# Altium project 单体V0.3.PrjPcb
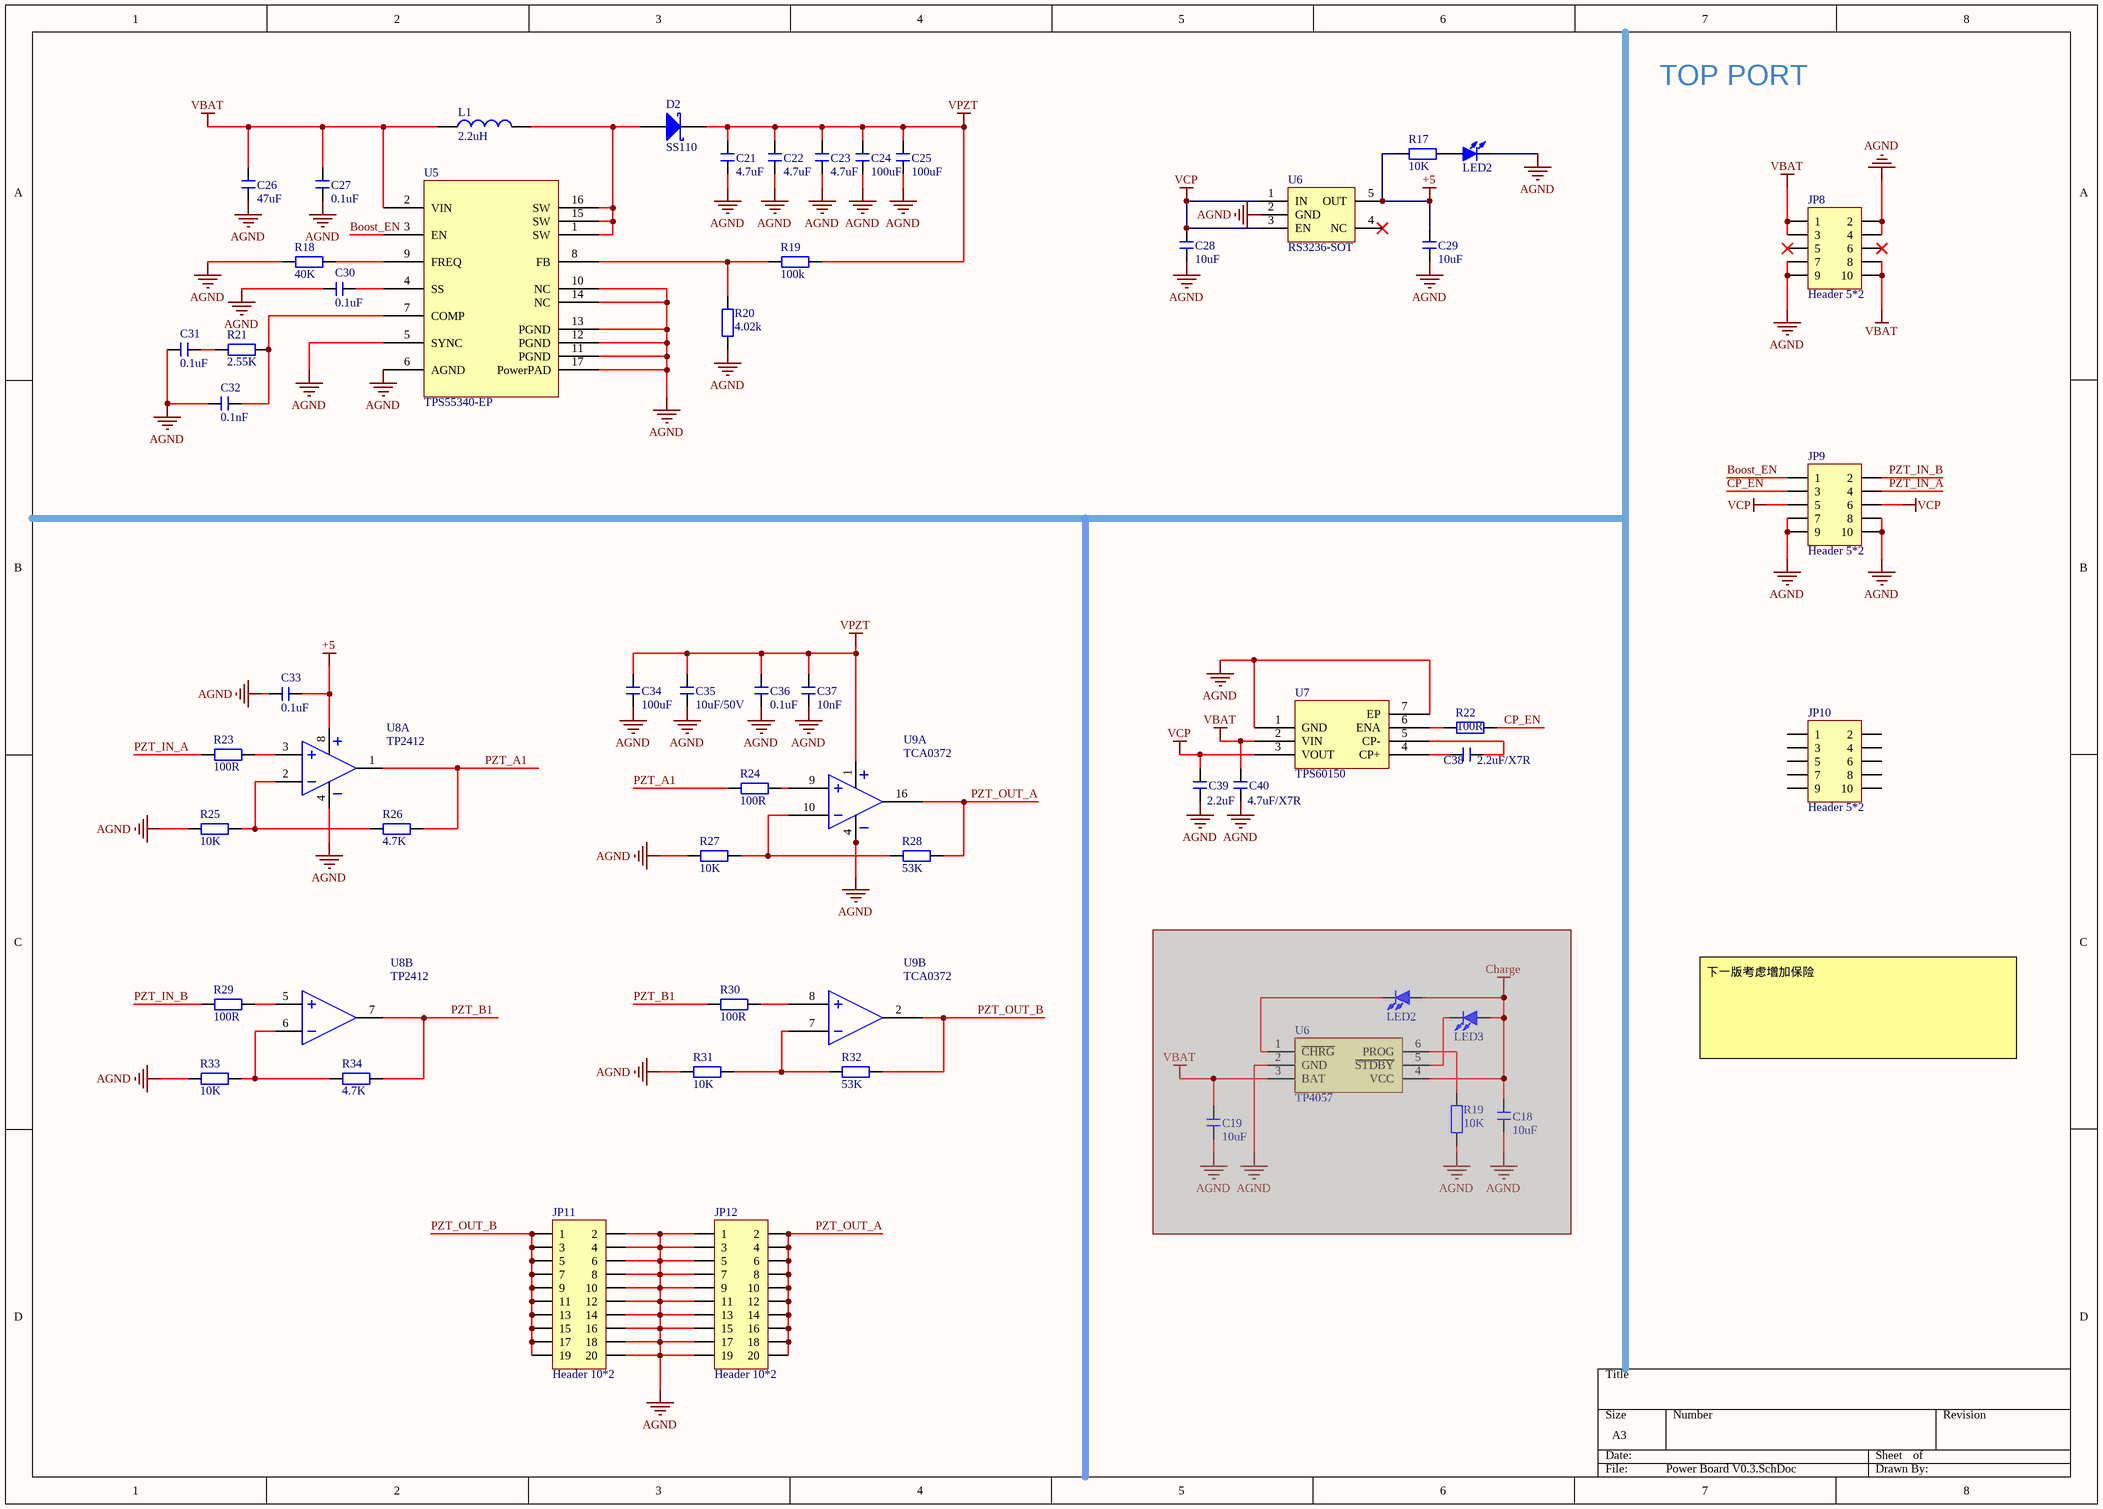
[diagram p0: Power Board V0.3.SchDoc]
5 sheets, 153 parts. Net scope: global (net labels, ports and power ports of the same name join across sheets).
Board files: Power Board V0.3.PcbDoc, Controller Board V0.3.PcbDoc, Function Board V0.3.PcbDoc, PZT Board.PcbDoc, DAP Board V0.3.PcbDoc
Sheets:
  Power Board V0.3.SchDoc
  Controller Board V0.3.SchDoc
  Function Board V0.3.SchDoc
  PZT Board.SchDoc
  DAP Board V0.3.SchDoc

## Sheet Power Board V0.3.SchDoc
size A3; SheetNumber: 1; SheetTotal: 4

### Parts
(Parts that share a designator on the sheet are numbered #1, #2 ... from top to bottom, then left to right.)
C18#1  10uF  [C 0603_L]  (masked out: inside a compile mask, not in the netlist)
C19#1  10uF  [C 0603_L]  (masked out: inside a compile mask, not in the netlist)
C21  4.7uF  [C 0603_L]
C22  4.7uF  [C 0603_L]
C23  4.7uF  [C 0603_L]
C24  100uF  [C 1206_L]
C25  100uF  [C 1206_L]
C26  47uF  [C 1206_L]
C27  0.1uF  [C 0603_L]
C28  10uF  [C 0603_L]
C29  10uF  [C 0603_L]
C30  0.1uF  [C 0603_L]
C31  0.1uF  [C 0603_L]
C32  0.1nF  [C 0603_L]
C33  0.1uF  [C 0603_L]
C34  100uF  [C 1206_L]
C35  10uF/50V  [C 0805_L]
C36  0.1uF  [C 0603_L]
C37  10nF  [C 0603_L]
C38  2.2uF/X7R  [C 0603_L]
C39  2.2uF  [C 0603_L]
C40  4.7uF/X7R  [C 0603_L]
D2  SS110  [SMA]
JP8  Header 5*2  [BTB-0.8mm-SMD-F-2*5PIN]
JP9  Header 5*2  [BTB-0.8mm-SMD-F-2*5PIN]
JP10  Header 5*2  [BTB-0.8mm-SMD-F-2*5PIN]
JP11  Header 10*2  [BTB-0.5MM-SMD-F_2*10PIN]
JP12  Header 10*2  [BTB-0.5MM-SMD-F_2*10PIN]
L1  2.2uH  [0530]
LED2#1  红色  [LED 0603G]  (value not drawn)
LED2#2  红色  [LED 0603R]  (value not drawn)  (masked out: inside a compile mask, not in the netlist)
LED3  红色  [LED 0603G]  (value not drawn)  (masked out: inside a compile mask, not in the netlist)
R17  10K  [R 0603_L]
R18  40K  [R 0603_L]
R19#1  100k  [R 0603_L]
R19#2  10K  [R 0603_L]  (masked out: inside a compile mask, not in the netlist)
R20  4.02k  [R 0603_L]
R21#1  2.55K  [R 0603_L]
R22  100R  [R 0603_L]
R23  100R  [R 0603_L]
R24  100R  [R 0603_L]
R25  10K  [R 0603_L]
R26  4.7K  [R 0603_L]
R27  10K  [R 0603_L]
R28  53K  [R 0603_L]
R29  100R  [R 0603_L]
R30  100R  [R 0603_L]
R31  10K  [R 0603_L]
R32  53K  [R 0603_L]
R33  10K  [R 0603_L]
R34  4.7K  [R 0603_L]
U5  TPS55340-EP  [QFN16]
U6#1  RS3236-SOT  [SOT23-5L]
U6#2  TP4057  [SOT23-6L]  (masked out: inside a compile mask, not in the netlist)
U7  TPS60150  [WSON-6Pin]
U8  TP2412  [MSOP8_L]  (parts A,B of 2)
U9  TCA0372  [SOP16W_N]  (parts A,B of 2)

### Nets
+5: C29.2 C33.2 R17.2 U6#1.5(OUT) U8.8(+Vs)
AGND: C21.1 C22.1 C23.1 C24.1 C25.1 C26.1 C27.1 C28.1 C29.1 C30.1 C31.1 C32.1 C33.1 C34.1 C35.1 C36.1 C37.2 C39.1 C40.1 JP8.2 JP8.4 JP8.7 JP8.9 JP9.7 JP9.8 JP9.9 JP9.10 JP11.2 JP11.4 JP11.6 JP11.8 JP11.10 JP11.12 JP11.14 JP11.16 JP11.18 JP11.20 JP12.1 JP12.3 JP12.5 JP12.7 JP12.9 JP12.11 JP12.13 JP12.15 JP12.17 JP12.19 LED2#1.2(K) R18.1 R20.1 R25.1 R27.1 R31.1 R33.1 U5.5(SYNC) U5.6(AGND) U5.10(NC) U5.11(PGND) U5.12(PGND) U5.13(PGND) U5.14(NC) U5.17(PowerPAD) U6#1.2(GND) U7.1(GND) U7.7(EP) U8.4(-Vs) U9.4(GND) U9.5(GND) U9.12(GND) U9.13(GND)
VBAT: C26.2 C27.2 C40.2 JP8.1 JP8.3 JP8.8 JP8.10 L1.1 U5.2(VIN) U7.2(VIN)
VCP: C28.2 C39.2 JP9.5 JP9.6 U6#1.1(IN) U6#1.3(EN) U7.3(VOUT)
VPZT: C21.2 C22.2 C23.2 C24.2 C25.2 C34.2 C35.2 C36.2 C37.1 D2.2(K) R19#1.2 U9.1
Boost_EN: JP9.1 U5.3(EN)
CP_EN: JP9.3 R22.1
PZT_A1: R24.1 R26.2 U8.1(Out)
PZT_B1: R30.1 R34.2 U8.7(Out)
PZT_IN_A: JP9.4 R23.1
PZT_IN_B: JP9.2 R29.1
PZT_OUT_A: JP12.2 JP12.4 JP12.6 JP12.8 JP12.10 JP12.12 JP12.14 JP12.16 JP12.18 JP12.20 R28.2 U9.16
PZT_OUT_B: JP11.1 JP11.3 JP11.5 JP11.7 JP11.9 JP11.11 JP11.13 JP11.15 JP11.17 JP11.19 R32.2 U9.2
NetC30_2: C30.2 U5.4(SS)
NetC31_2: C31.2 R21#1.1
NetC32_2: C32.2 R21#1.2 U5.7(COMP)
NetC38_1: C38.1 U7.4(CP+)
NetC38_2: C38.2 U7.5(CP-)
NetD2_1: D2.1(A) L1.2 U5.1(SW) U5.15(SW) U5.16(SW)
NetLED2#1_1: LED2#1.1(A) R17.1
NetR18_2: R18.2 U5.9(FREQ)
NetR19#1_1: R19#1.1 R20.2 U5.8(FB)
NetR22_2: R22.2 U7.6(ENA)
NetR23_2: R23.2 U8.3(In+)
NetR24_2: R24.2 U9.9
NetR25_2: R25.2 R26.1 U8.2(In-)
NetR27_2: R27.2 R28.1 U9.10
NetR29_2: R29.2 U8.5(In+)
NetR30_2: R30.2 U9.8
NetR31_2: R31.2 R32.1 U9.7
NetR33_2: R33.2 R34.1 U8.6(In-)

Not connected (* = marked no-connect by the designer): JP8 5* 6*; JP10 1 2 3 4 5 6 7 8 9 10; U6#1 4(NC)*

### Notes on the sheet
- TOP PORT
- 下一版考虑增加保险

### Library data of the parts
C18#1 C19#1 C21-C40 = C: 贴片电容; BOM名称: 无极性贴片电容; 淘宝ID: 封装库来自淘宝 ID：黄晶宝石; 联系售后: https://shop463601444.taobao.com
D2 = SS14: 肖特基二极管; 属性: 40V/1A; BOM名称: 肖特基二极管; 封装库来自淘宝 ID：黄晶宝石: https://shop463601444.taobao.com
JP8-JP10 = Header 5*2: BTB Connector
JP11 JP12 = Header 10*2: BTB Connector
L1 = L-: 一体成型电感; 淘宝ID: 封装库来自淘宝 ID：黄晶宝石; BOM名称: 一体成型电感; 联系售后: https://shop463601444.taobao.com
LED2#1 LED2#2 LED3 = LED-SMD: 贴片LED; 版权归属: 封装库来自淘宝 ID：黄晶宝石; BOM名称: 贴片LED; 学习资源: https://shop463601444.taobao.com
R17 R18 R19#1 R19#2 R20 R21#1 R22-R34 = R: 贴片电阻; 版权归属: 来自淘宝 ID：黄晶宝石; BOM名称: 贴片电阻; 联系售后: https://shop463601444.taobao.com
U5 = TPS55340-EP: 增强型集成式 5A、40V 宽输入范围升压/SEPIC/反激式直流/直流稳压器
U6#1 = RS3236-SOT: 500mA LDO
U6#2 = TP4057: 500ma双灯指示 防反接锂电池充电管理; 淘宝ID: 封装库来自淘宝 ID：黄晶宝石; BOM名称: 锂电池充电管理; 学习资源: https://shop463601444.taobao.com
U7 = TPS60150: 采用2*2SON封装的140mA、5V电荷泵
U8 = TP2412: 10MHz Bandwidth, Low Noise Precision Op‐amps

## Sheet Controller Board V0.3.SchDoc
size A3; SheetNumber: 2; SheetTotal: 5
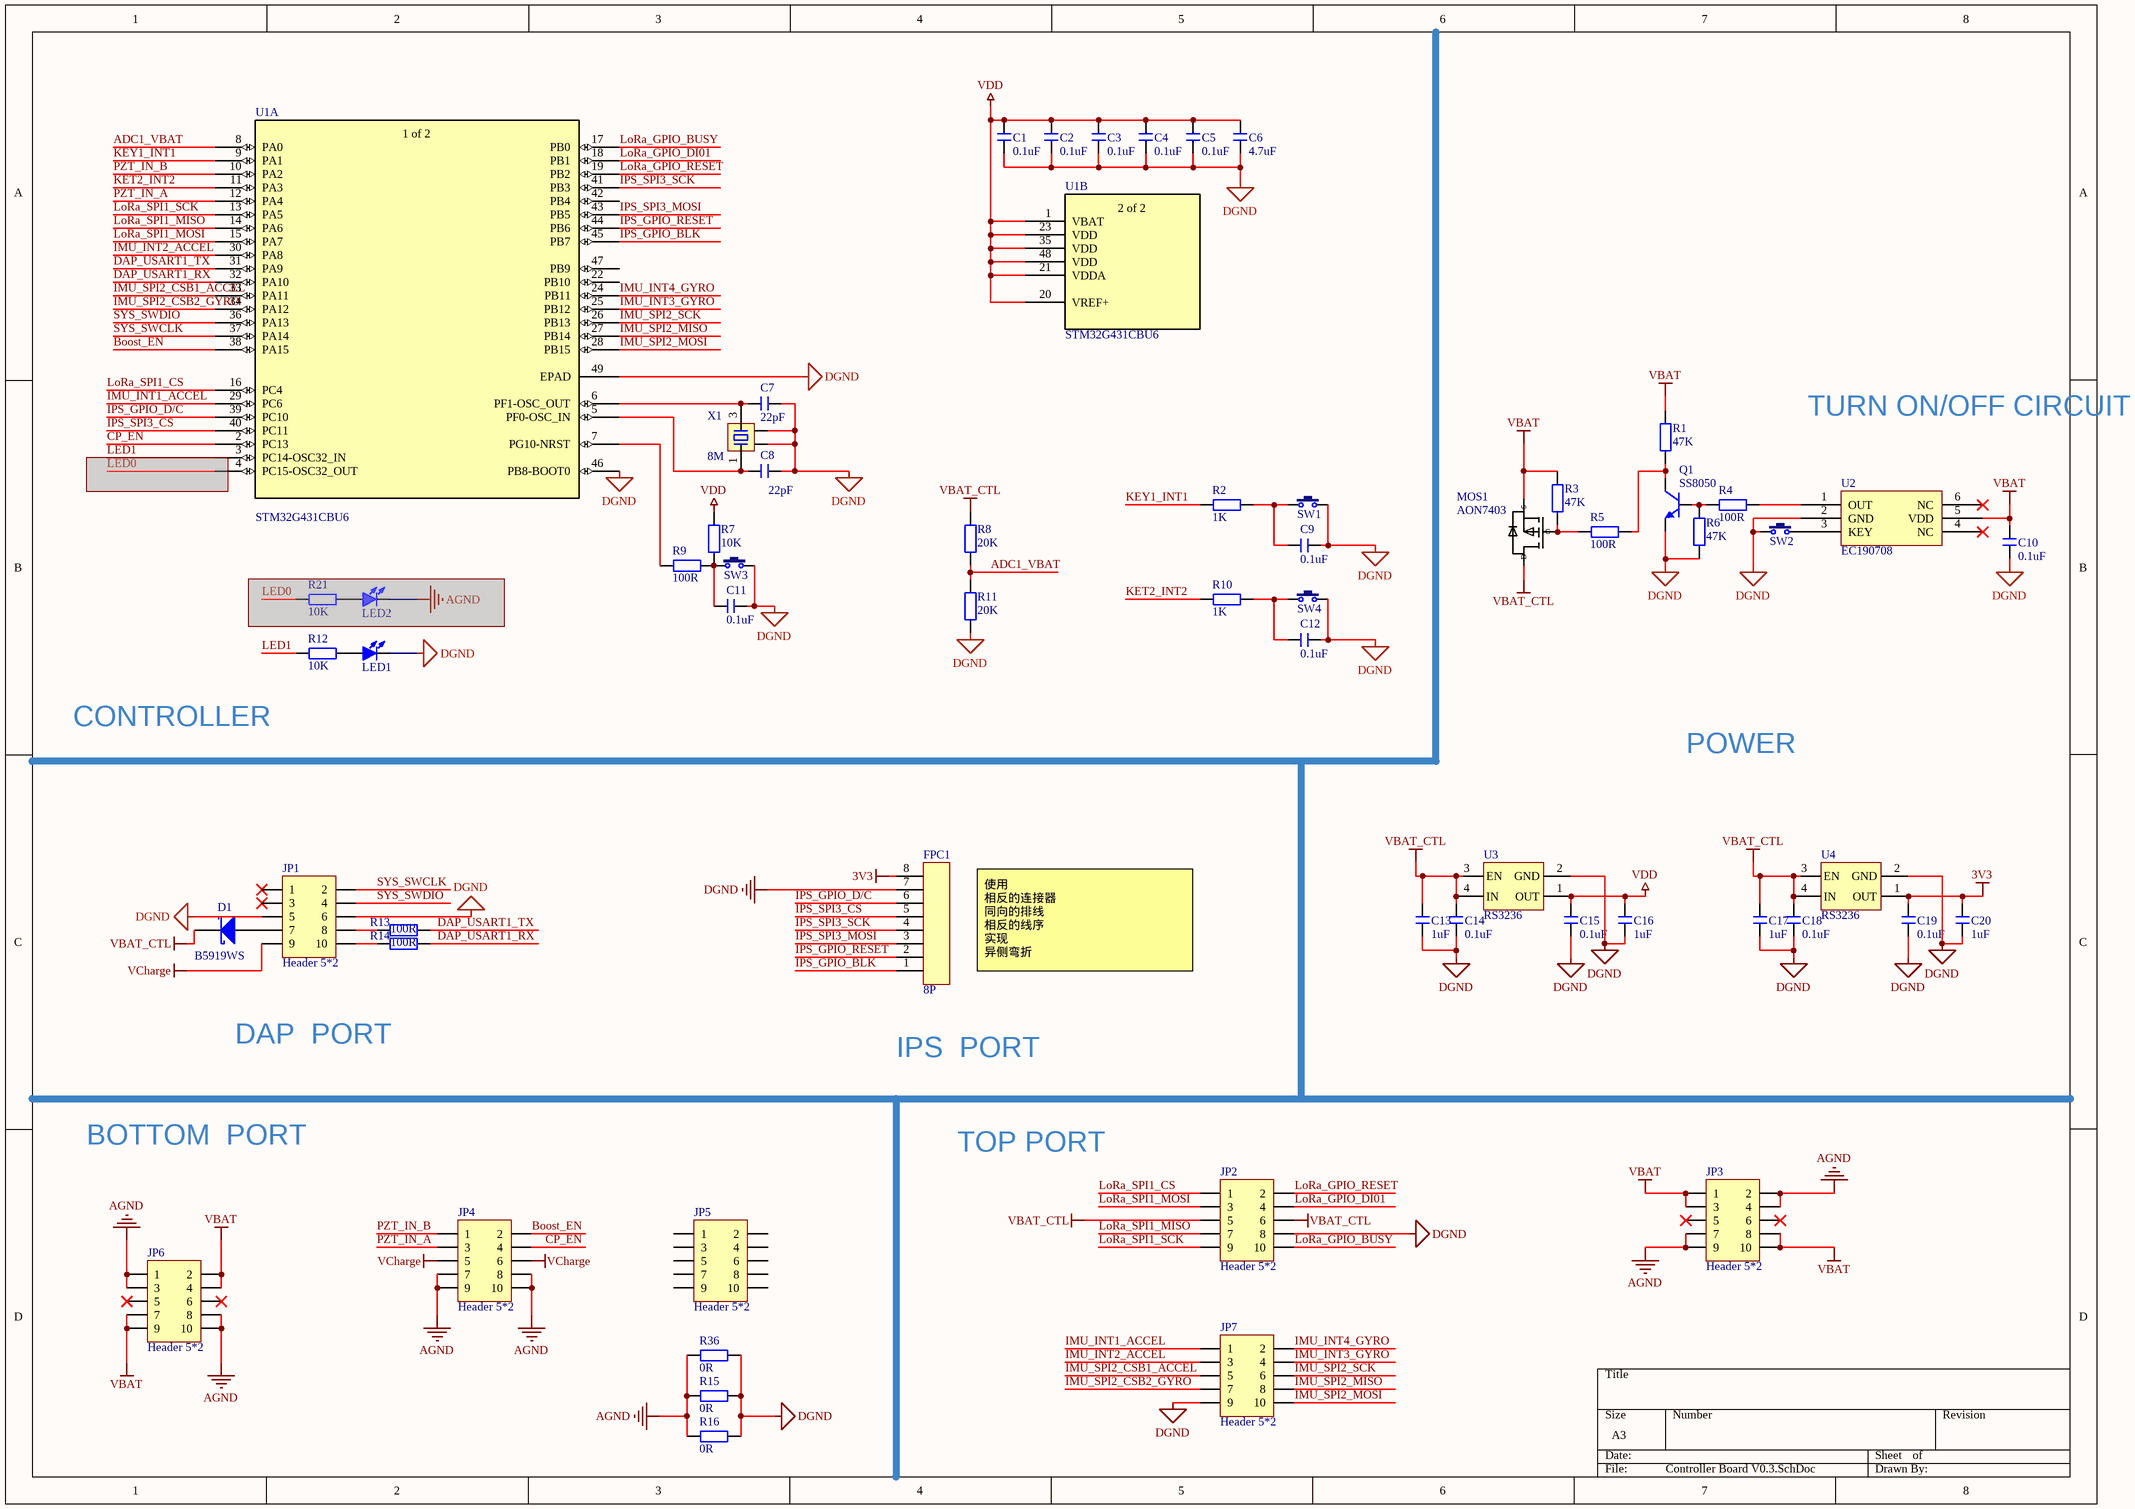
[diagram p1: Controller Board V0.3.SchDoc]

### Parts
(Parts that share a designator on the sheet are numbered #1, #2 ... from top to bottom, then left to right.)
C1  0.1uF  [C 0603_L]
C2  0.1uF  [C 0603_L]
C3  0.1uF  [C 0603_L]
C4  0.1uF  [C 0603_L]
C5  0.1uF  [C 0603_L]
C6  4.7uF  [C 0603_L]
C7  22pF  [C 0603_L]
C8  22pF  [C 0603_L]
C9  0.1uF  [C 0603_L]
C10  0.1uF  [C 0603_L]
C11  0.1uF  [C 0603_L]
C12  0.1uF  [C 0603_L]
C13  1uF  [C 0603_L]
C14  0.1uF  [C 0603_L]
C15  0.1uF  [C 0603_L]
C16  1uF  [C 0603_L]
C17  1uF  [C 0603_L]
C18#2  0.1uF  [C 0603_L]
C19#2  0.1uF  [C 0603_L]
C20  1uF  [C 0603_L]
D1  B5919WS  [SOD-523]
FPC1  8P  [FPC0.5 2H-WS-8P]
JP1  Header 5*2  [BTB-0.8MM-SMD-BF-2*5PIN]
JP2  Header 5*2  [BTB-0.8mm-SMD-F-2*5PIN]
JP3  Header 5*2  [BTB-0.8mm-SMD-F-2*5PIN]
JP4  Header 5*2  [BTB-0.8mm-SMD-F-2*5PIN]
JP5  Header 5*2  [BTB-0.8mm-SMD-F-2*5PIN]
JP6  Header 5*2  [BTB-0.8mm-SMD-F-2*5PIN]
JP7  Header 5*2  [BTB-0.8mm-SMD-F-2*5PIN]
LED1  红色  [LED 0603G]  (value not drawn)
LED2#3  红色  [LED 0603G]  (value not drawn)  (masked out: inside a compile mask, not in the netlist)
MOS1  AON7403  [DFN3x3_8]
Q1  SS8050  [SOT23-3L]
R1  47K  [R 0603_L]
R2  1K  [R 0603_L]
R3  47K  [R 0603_L]
R4  100R  [R 0603_L]
R5  100R  [R 0603_L]
R6  47K  [R 0603_L]
R7  10K  [R 0603_L]
R8  20K  [R 0603_L]
R9  100R  [R 0603_L]
R10  1K  [R 0603_L]
R11  20K  [R 0603_L]
R12  10K  [R 0603_L]
R13  100R  [R 0603_L]
R14  100R  [R 0603_L]
R15  0R  [R 0603_L]
R16  0R  [R 0603_L]
R21#2  10K  [R 0603_L]  (masked out: inside a compile mask, not in the netlist)
R36  0R  [R 0603_L]
SW1  3x6x5  [TSW 2*4*3.5-S-W]  (value not drawn)
SW2  3x6x5  [TSW 2*4*3.5-S-W]  (value not drawn)
SW3  3x6x5  [TSW 2*4*3.5-S-W]  (value not drawn)
SW4  3x6x5  [TSW 2*4*3.5-S-W]  (value not drawn)
U1  STM32G431CBU6  [QFN48 7X7_L]  (parts A,B of 2)
U2  EC190708  [SOT23-6L]
U3  RS3236  [UTDFN1x1-4]
U4  RS3236  [UTDFN1x1-4]
X1  8M  [OSC 2025-4P]

### Nets
3V3: C19#2.1 C20.2 FPC1.8 U4.1(OUT)
AGND: JP3.2 JP3.4 JP3.7 JP3.9 JP4.7 JP4.8 JP4.9 JP4.10 JP6.1 JP6.3 JP6.8 JP6.10 R15.2 R16.2 R36.2
DGND: C1.1 C2.1 C3.1 C4.1 C5.1 C6.1 C7.2 C8.2 C9.2 C10.1 C11.2 C12.2 C13.1 C14.2 C15.2 C16.1 C17.1 C18#2.2 C19#2.2 C20.1 FPC1.7 JP1.5 JP1.6 JP2.8 JP7.9 LED1.2(K) Q1.2(E) R6.2 R11.1 R15.1 R16.1 R36.1 SW1.2 SW2.1 SW3.2 SW4.2 U1.46(PB8-BOOT0) U1.49(EPAD) U2.2(GND) U3.2(GND) U4.2(GND) X1.2 X1.4
VBAT: C10.2 JP3.1 JP3.3 JP3.8 JP3.10 JP6.2 JP6.4 JP6.7 JP6.9 MOS1.1(S) R1.2 R3.1 U2.5(VDD)
VBAT_CTL: C13.2 C14.1 C17.2 C18#2.1 D1.2(K) JP2.5 JP2.6 MOS1.3(D) R8.1 U3.3(EN) U3.4(IN) U4.3(EN) U4.4(IN)
VCharge: JP1.9 JP4.5 JP4.6
VDD: C1.2 C2.2 C3.2 C4.2 C5.2 C6.2 C15.1 C16.2 R7.1 U1.1(VBAT) U1.20(VREF+) U1.21(VDDA) U1.23(VDD) U1.35(VDD) U1.48(VDD) U3.1(OUT)
ADC1_VBAT: R8.2 R11.2 U1.8(PA0)
Boost_EN: JP4.2 U1.38(PA15)
CP_EN: JP4.4 U1.2(PC13)
DAP_USART1_RX: R14.1 U1.32(PA10)
DAP_USART1_TX: R13.1 U1.31(PA9)
IMU_INT1_ACCEL: JP7.1 U1.29(PC6)
IMU_INT2_ACCEL: JP7.3 U1.30(PA8)
IMU_INT3_GYRO: JP7.4 U1.25(PB12)
IMU_INT4_GYRO: JP7.2 U1.24(PB11)
IMU_SPI2_CSB1_ACCEL: JP7.5 U1.33(PA11)
IMU_SPI2_CSB2_GYRO: JP7.7 U1.34(PA12)
IMU_SPI2_MISO: JP7.8 U1.27(PB14)
IMU_SPI2_MOSI: JP7.10 U1.28(PB15)
IMU_SPI2_SCK: JP7.6 U1.26(PB13)
IPS_GPIO_BLK: FPC1.1 U1.45(PB7)
IPS_GPIO_D/C: FPC1.6 U1.39(PC10)
IPS_GPIO_RESET: FPC1.2 U1.44(PB6)
IPS_SPI3_CS: FPC1.5 U1.40(PC11)
IPS_SPI3_MOSI: FPC1.3 U1.43(PB5)
IPS_SPI3_SCK: FPC1.4 U1.41(PB3)
KET2_INT2: R10.1 U1.11(PA3)
KEY1_INT1: R2.1 U1.9(PA1)
LED1: R12.2
LoRa_GPIO_BUSY: JP2.10 U1.17(PB0)
LoRa_GPIO_DI01: JP2.4 U1.18(PB1)
LoRa_GPIO_RESET: JP2.2 U1.19(PB2)
LoRa_SPI1_CS: JP2.1 U1.16(PC4)
LoRa_SPI1_MISO: JP2.7 U1.14(PA6)
LoRa_SPI1_MOSI: JP2.3 U1.15(PA7)
LoRa_SPI1_SCK: JP2.9 U1.13(PA5)
PZT_IN_A: JP4.3 U1.12(PA4)
PZT_IN_B: JP4.1 U1.10(PA2)
SYS_SWCLK: JP1.2 U1.37(PA14)
SYS_SWDIO: JP1.4 U1.36(PA13)
NetC7_1: C7.1 U1.6(PF1-OSC_OUT) X1.3
NetC8_1: C8.1 U1.5(PF0-OSC_IN) X1.1
NetC9_1: C9.1 R2.2 SW1.1
NetC11_1: C11.1 R7.2 R9.1 SW3.1
NetC12_1: C12.1 R10.2 SW4.1
NetD1_1: D1.1(A) JP1.7
NetJP1_8: JP1.8 R13.2
NetJP1_10: JP1.10 R14.2
NetLED1_1: LED1.1(A) R12.1
NetMOS1_2: MOS1.2(G) R3.2 R5.1
NetQ1_1: Q1.1(B) R4.1 R6.1
NetQ1_3: Q1.3(C) R1.1 R5.2
NetR4_2: R4.2 U2.1(OUT)
NetR9_2: R9.2 U1.7(PG10-NRST)
NetSW2_2: SW2.2 U2.3(KEY)

Not connected (* = marked no-connect by the designer): JP1 1* 3*; JP3 5* 6*; JP5 1 2 3 4 5 6 7 8 9 10; JP6 5* 6*; U1 3(PC14-OSC32_IN) 4(PC15-OSC32_OUT) 22(PB10) 42(PB4) 47(PB9); U2 4(NC)* 6(NC)*

### Notes on the sheet
- TURN ON/OFF CIRCUIT
- CONTROLLER
- POWER
- 使用
  相反的连接器
  同向的排线
  相反的线序
  实现
  异侧弯折
- DAP  PORT
- IPS  PORT
- BOTTOM  PORT
- TOP PORT
- (in symbol STM32G431CBU6, part A) 1 of 2
- (in symbol STM32G431CBU6, part B) 2 of 2

### Library data of the parts
C1-C17 C18#2 C19#2 C20 = C: as C18#1 on sheet Power Board V0.3; 联系售后: https://shop463601444.taobao.com
D1 = 1N5819: 肖特基二极管; 淘宝ID: 封装库来自淘宝 ID：黄晶宝石; 属性: 40V/2A; BOM名称: 肖特基二极管; 欢迎光临: https://shop463601444.taobao.com
JP1-JP7 = Header 5*2: BTB Connector
LED1 LED2#3 = LED-SMD: 贴片LED; 版权归属: 封装库来自淘宝 ID：黄晶宝石; BOM名称: 贴片LED; 学习资源: https://shop463601444.taobao.com
MOS1 = AON7403: P沟道30V MOSFET
Q1 = 8050-SMD: 高频放大-NPN型; 版权归属: 封装库来自淘宝 ID：黄晶宝石; 属性: 40V 1.5A 1W 100MHZ; BOM名称: 高频放大-NPN型; 联系售后: https://shop463601444.taobao.com
R1-R16 R21#2 R36 = R: 贴片电阻; 版权归属: 来自淘宝 ID：黄晶宝石; BOM名称: 贴片电阻; 联系售后: https://shop463601444.taobao.com
SW1-SW4 = TSW 3x6: 3x6轻触开关; 版权归属: 封装库来自淘宝 ID：黄晶宝石; BOM名称: 3x6轻触开关; 学习资源: www.ooocke.com
U1 = STM32G431CBU6: 带DSP和FPU的170MHz主流ARM Cortex-M4 MCU，具有128KB Flash存储器、数学加速器和中等模拟电平集成; Mfr_Name: STMicroelectronics; RefDes: RefDes; Type: Type
U2 = EC190708: 长按三秒开关机
U3 U4 = RS3236: 500mA LDO
X1 = XTAL-4P: 4脚无源晶振; 版权归属: 源创客; BOM名称: 4脚无源晶振; 学习资源: www.ooocke.com

## Sheet Function Board V0.3.SchDoc
size A4; SheetNumber: 3; SheetTotal: 5
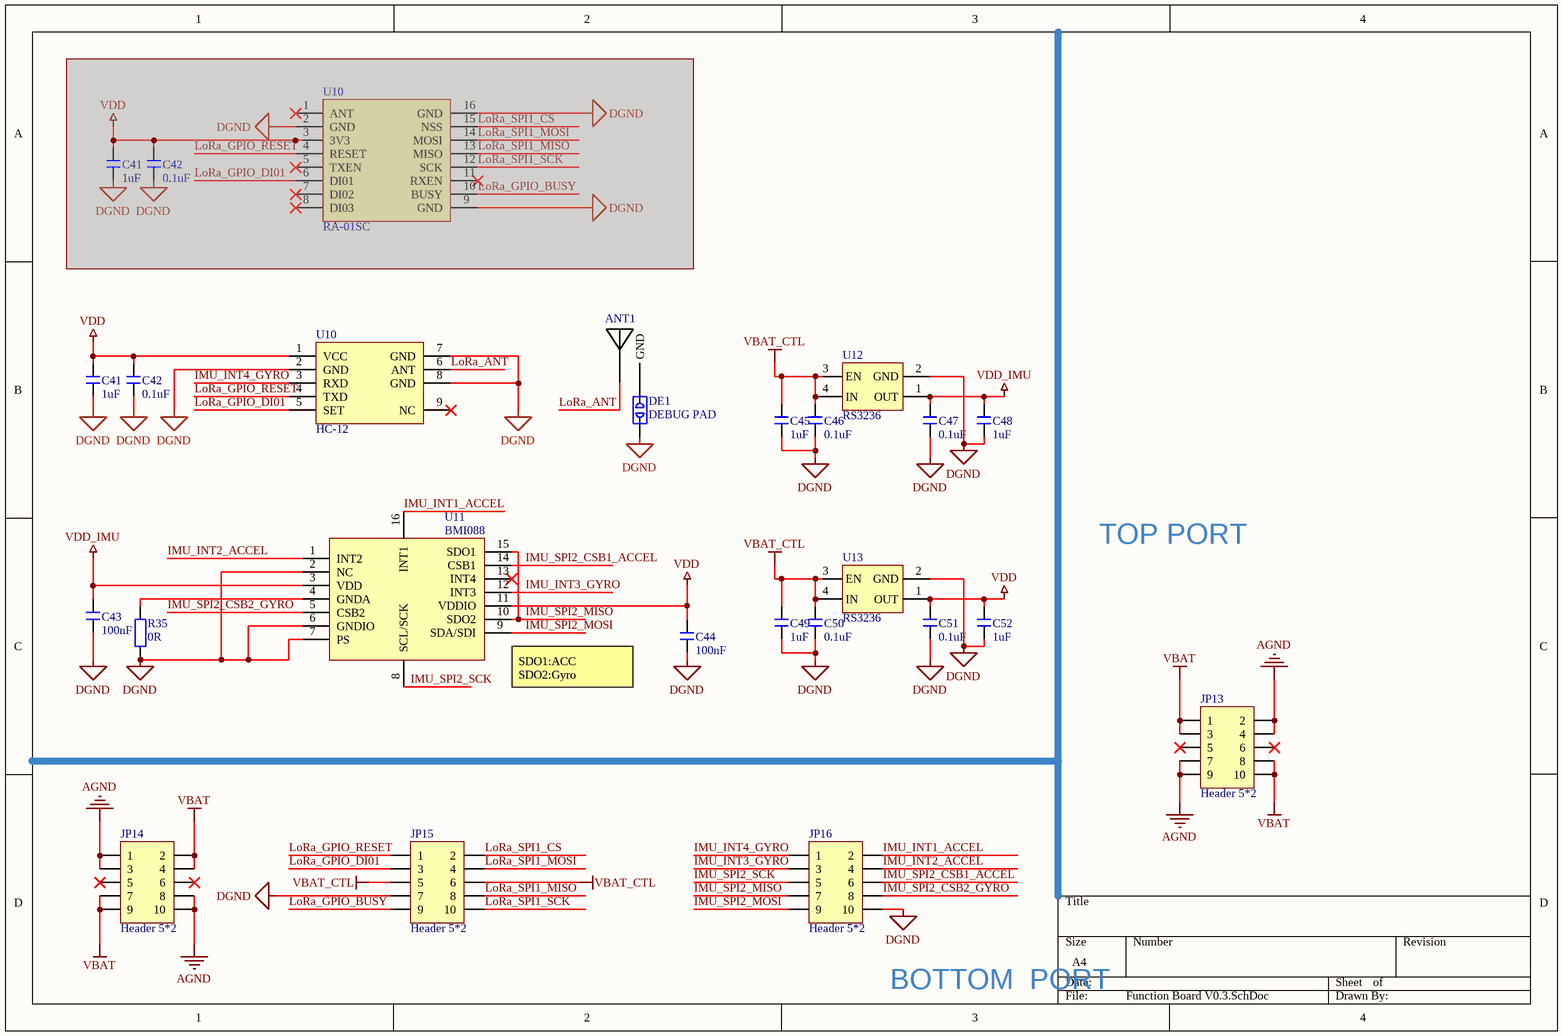
[diagram p2: Function Board V0.3.SchDoc]

### Parts
(Parts that share a designator on the sheet are numbered #1, #2 ... from top to bottom, then left to right.)
ANT1  FTP_ANT  [FTP ANT]  (value not drawn)
C41#1  1uF  [C 0603_L]  (masked out: inside a compile mask, not in the netlist)
C41#2  1uF  [C 0603_L]
C42#1  0.1uF  [C 0603_L]  (masked out: inside a compile mask, not in the netlist)
C42#2  0.1uF  [C 0603_L]
C43  100nF  [C 0603_L]
C44  100nF  [C 0603_L]
C45  1uF  [C 0603_L]
C46  0.1uF  [C 0603_L]
C47  0.1uF  [C 0603_L]
C48  1uF  [C 0603_L]
C49  1uF  [C 0603_L]
C50  0.1uF  [C 0603_L]
C51  0.1uF  [C 0603_L]
C52  1uF  [C 0603_L]
DE1  DEBUG PAD  [DEBUG_B]
JP13  Header 5*2  [BTB-0.8mm-SMD-F-2*5PIN]
JP14  Header 5*2  [BTB-0.8mm-SMD-F-2*5PIN]
JP15  Header 5*2  [BTB-0.8mm-SMD-F-2*5PIN]
JP16  Header 5*2  [BTB-0.8mm-SMD-F-2*5PIN]
R35  0R  [R 0603_L]
U10#1  RA-01SC  [RA-01S-SMT]  (masked out: inside a compile mask, not in the netlist)
U10#2  HC-12  [HC-12]
U11  BMI088  [LGA-16_L4.5-W3.0-P0.50-BL]
U12  RS3236  [UTDFN1x1-4]
U13  RS3236  [UTDFN1x1-4]

### Nets
AGND: JP13.2 JP13.4 JP13.7 JP13.9 JP14.1 JP14.3 JP14.8 JP14.10
DGND: C41#2.1 C42#2.2 C43.1 C44.1 C45.1 C46.2 C47.2 C48.1 C49.1 C50.2 C51.2 C52.1 DE1.1 JP15.7 JP16.10 R35.1 U10#2.2(GND) U10#2.7(GND) U10#2.8(GND) U11.2(NC) U11.6(GNDIO) U11.7(PS) U12.2(GND) U13.2(GND)
VBAT: JP13.1 JP13.3 JP13.8 JP13.10 JP14.2 JP14.4 JP14.7 JP14.9
VBAT_CTL: C45.2 C46.1 C49.2 C50.1 JP15.5 JP15.6 U12.3(EN) U12.4(IN) U13.3(EN) U13.4(IN)
VDD: C41#2.2 C42#2.1 C44.2 C51.1 C52.2 U10#2.1(VCC) U11.11(VDDIO) U13.1(OUT)
VDD_IMU: C43.2 C47.1 C48.2 U11.3(VDD) U12.1(OUT)
IMU_INT1_ACCEL: JP16.2 U11.16(INT1)
IMU_INT2_ACCEL: JP16.4 U11.1(INT2)
IMU_INT3_GYRO: JP16.3 U11.12(INT3)
IMU_INT4_GYRO: JP16.1 U10#2.3(RXD)
IMU_SPI2_CSB1_ACCEL: JP16.6 U11.14(CSB1)
IMU_SPI2_CSB2_GYRO: JP16.8 U11.5(CSB2)
IMU_SPI2_MISO: JP16.7 U11.10(SDO2) U11.15(SDO1)
IMU_SPI2_MOSI: JP16.9 U11.9(SDA/SDI)
IMU_SPI2_SCK: JP16.5 U11.8(SCL/SCK)
LoRa_ANT: ANT1.1 U10#2.6(ANT)
LoRa_GPIO_BUSY: JP15.9
LoRa_GPIO_DI01: JP15.3 U10#2.5(SET)
LoRa_GPIO_RESET: JP15.1 U10#2.4(TXD)
LoRa_SPI1_CS: JP15.2
LoRa_SPI1_MISO: JP15.8
LoRa_SPI1_MOSI: JP15.4
LoRa_SPI1_SCK: JP15.10
NetANT1_2: ANT1.2(GND) DE1.2
NetR35_2: R35.2 U11.4(GNDA)

Not connected (* = marked no-connect by the designer): JP13 5* 6*; JP14 5* 6*; U10#2 9(NC)*; U11 13(INT4)*

### Notes on the sheet
- TOP PORT
- (near U11) SDO1:ACC
  SDO2:Gyro
- BOTTOM  PORT

### Library data of the parts
ANT1 = FTP_ANT: 陶瓷天线; BOM名称: PCB板载天线; 版权归属: 封装库来自淘宝 ID：黄晶宝石; 学习资源: https://shop463601444.taobao.com
C41#1 C41#2 C42#1 C42#2 C43-C52 = C: as C18#1 on sheet Power Board V0.3; 联系售后: https://shop463601444.taobao.com
DE1 = DEBUG: 调试断点焊盘; 版权归属: 封装库来自淘宝 ID：黄晶宝石; BOM名称: 调试断点焊盘; 学习资源: https://shop463601444.taobao.com
JP13-JP16 = Header 5*2: BTB Connector
R35 = R: 贴片电阻; 版权归属: 来自淘宝 ID：黄晶宝石; BOM名称: 贴片电阻; 联系售后: https://shop463601444.taobao.com
U10#1 = RA-01SC: 安信可LoRa; BOM名称: MP3模块; 版权归属: 封装库来自淘宝 ID：黄晶宝石; 学习资源: https://shop463601444.taobao.com
U10#2 = HC-12: 433MHz无线串口模块
U11 = BMI088: 6-axis Motion Tracking for High-performance Applications
U12 U13 = RS3236: 500mA LDO

## Sheet PZT Board.SchDoc
size A4; SheetNumber: 4; SheetTotal: 4
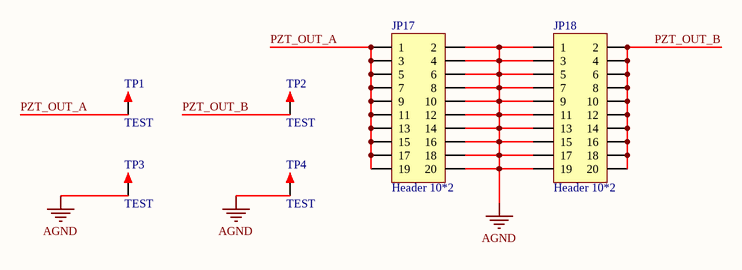
[diagram p3: PZT Board.SchDoc]

### Parts
JP17  Header 10*2  [BTB-0.5MM-SMD-M_2*10PIN]
JP18  Header 10*2  [BTB-0.5MM-SMD-M_2*10PIN]
TP1  TEST  [TEST 2.0]
TP2  TEST  [TEST 2.0]
TP3  TEST  [TEST 2.0]
TP4  TEST  [TEST 2.0]

### Nets
AGND: JP17.2 JP17.4 JP17.6 JP17.8 JP17.10 JP17.12 JP17.14 JP17.16 JP17.18 JP17.20 JP18.1 JP18.3 JP18.5 JP18.7 JP18.9 JP18.11 JP18.13 JP18.15 JP18.17 JP18.19 TP3.1 TP4.1
PZT_OUT_A: JP17.1 JP17.3 JP17.5 JP17.7 JP17.9 JP17.11 JP17.13 JP17.15 JP17.17 JP17.19 TP1.1
PZT_OUT_B: JP18.2 JP18.4 JP18.6 JP18.8 JP18.10 JP18.12 JP18.14 JP18.16 JP18.18 JP18.20 TP2.1

### Library data of the parts
JP17 JP18 = Header 10*2: BTB Connector
TP1-TP4 = TEST: 测试点; 版权归属: 封装库来自淘宝 ID：黄晶宝石; BOM名称: 测试点; 学习资源: https://shop463601444.taobao.com

## Sheet DAP Board V0.3.SchDoc
size A4; SheetNumber: 5; SheetTotal: 5
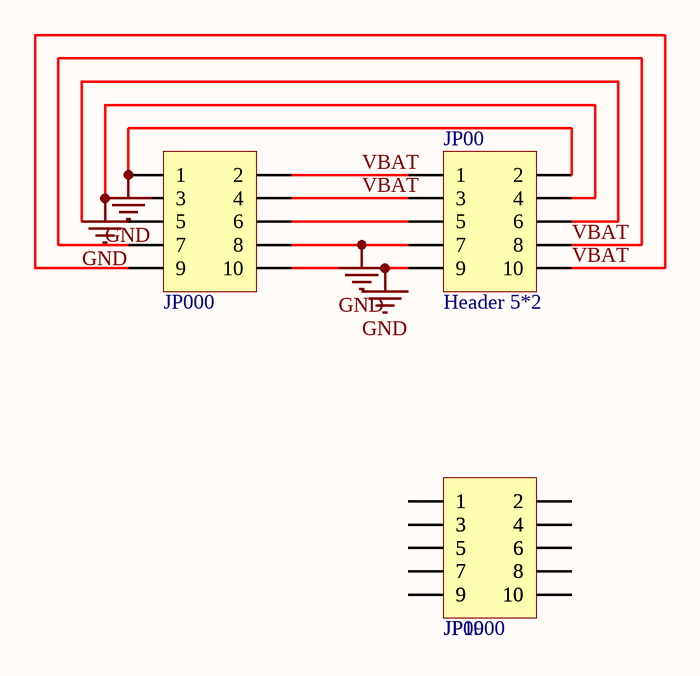
[diagram p4: DAP Board V0.3.SchDoc]

### Parts
JP00  Header 5*2  [BTB-0.8MM-SMD-BM-2*5PIN]
JP0000  Header 5X2  [HDR2.54-M-LS-2x5P]  (value not drawn)
JP000  Header 5X2  [HDR1.27-M-LS-2x5P]  (value not drawn)
JP19  Header 5X2  [HDR1.27-M-LS-2x5P]  (value not drawn)

### Nets
GND: JP000.1 JP00.2 JP000.3 JP00.4 JP00.7 JP000.8 JP00.9 JP000.10
VBAT: JP00.1 JP000.2 JP00.3 JP000.4 JP000.7 JP00.8 JP000.9 JP00.10
NetJP0000_1: JP0000.1 JP19.1
NetJP0000_2: JP0000.2 JP19.2
NetJP0000_3: JP0000.3 JP19.3
NetJP0000_4: JP0000.4 JP19.4
NetJP00_5: JP00.5 JP000.6
NetJP000_5: JP000.5 JP00.6
NetJP0000_5: JP0000.5 JP19.5
NetJP0000_6: JP0000.6 JP19.6
NetJP0000_7: JP0000.7 JP19.7
NetJP0000_8: JP0000.8 JP19.8
NetJP0000_9: JP0000.9 JP19.9
NetJP0000_10: JP0000.10 JP19.10

### Library data of the parts
JP00 = Header 5*2: BTB Connector
JP0000 JP000 JP19 = Header 5X2: 5*2P接插件; 版权归属: 封装库来自淘宝 ID：黄晶宝石; BOM名称: 5*2P接插件; 学习资源: https://shop463601444.taobao.com

## Nets that join several sheets
AGND: Power Board V0.3 (70 pins), Controller Board V0.3 (15 pins), Function Board V0.3 (8 pins), PZT Board (22 pins)
DGND: Controller Board V0.3 (43 pins), Function Board V0.3 (24 pins)
VBAT: Power Board V0.3 (10 pins), Controller Board V0.3 (13 pins), Function Board V0.3 (8 pins), DAP Board V0.3 (8 pins)
VBAT_CTL: Controller Board V0.3 (13 pins), Function Board V0.3 (10 pins)
VDD: Controller Board V0.3 (16 pins), Function Board V0.3 (8 pins)
Boost_EN: Power Board V0.3 (JP9.1 U5.3), Controller Board V0.3 (JP4.2 U1.38)
CP_EN: Power Board V0.3 (JP9.3 R22.1), Controller Board V0.3 (JP4.4 U1.2)
IMU_INT1_ACCEL: Controller Board V0.3 (JP7.1 U1.29), Function Board V0.3 (JP16.2 U11.16)
IMU_INT2_ACCEL: Controller Board V0.3 (JP7.3 U1.30), Function Board V0.3 (JP16.4 U11.1)
IMU_INT3_GYRO: Controller Board V0.3 (JP7.4 U1.25), Function Board V0.3 (JP16.3 U11.12)
IMU_INT4_GYRO: Controller Board V0.3 (JP7.2 U1.24), Function Board V0.3 (JP16.1 U10#2.3)
IMU_SPI2_CSB1_ACCEL: Controller Board V0.3 (JP7.5 U1.33), Function Board V0.3 (JP16.6 U11.14)
IMU_SPI2_CSB2_GYRO: Controller Board V0.3 (JP7.7 U1.34), Function Board V0.3 (JP16.8 U11.5)
IMU_SPI2_MISO: Controller Board V0.3 (JP7.8 U1.27), Function Board V0.3 (JP16.7 U11.10 U11.15)
IMU_SPI2_MOSI: Controller Board V0.3 (JP7.10 U1.28), Function Board V0.3 (JP16.9 U11.9)
IMU_SPI2_SCK: Controller Board V0.3 (JP7.6 U1.26), Function Board V0.3 (JP16.5 U11.8)
LoRa_GPIO_BUSY: Controller Board V0.3 (JP2.10 U1.17), Function Board V0.3 (JP15.9)
LoRa_GPIO_DI01: Controller Board V0.3 (JP2.4 U1.18), Function Board V0.3 (JP15.3 U10#2.5)
LoRa_GPIO_RESET: Controller Board V0.3 (JP2.2 U1.19), Function Board V0.3 (JP15.1 U10#2.4)
LoRa_SPI1_CS: Controller Board V0.3 (JP2.1 U1.16), Function Board V0.3 (JP15.2)
LoRa_SPI1_MISO: Controller Board V0.3 (JP2.7 U1.14), Function Board V0.3 (JP15.8)
LoRa_SPI1_MOSI: Controller Board V0.3 (JP2.3 U1.15), Function Board V0.3 (JP15.4)
LoRa_SPI1_SCK: Controller Board V0.3 (JP2.9 U1.13), Function Board V0.3 (JP15.10)
PZT_IN_A: Power Board V0.3 (JP9.4 R23.1), Controller Board V0.3 (JP4.3 U1.12)
PZT_IN_B: Power Board V0.3 (JP9.2 R29.1), Controller Board V0.3 (JP4.1 U1.10)
PZT_OUT_A: Power Board V0.3 (12 pins), PZT Board (11 pins)
PZT_OUT_B: Power Board V0.3 (12 pins), PZT Board (11 pins)